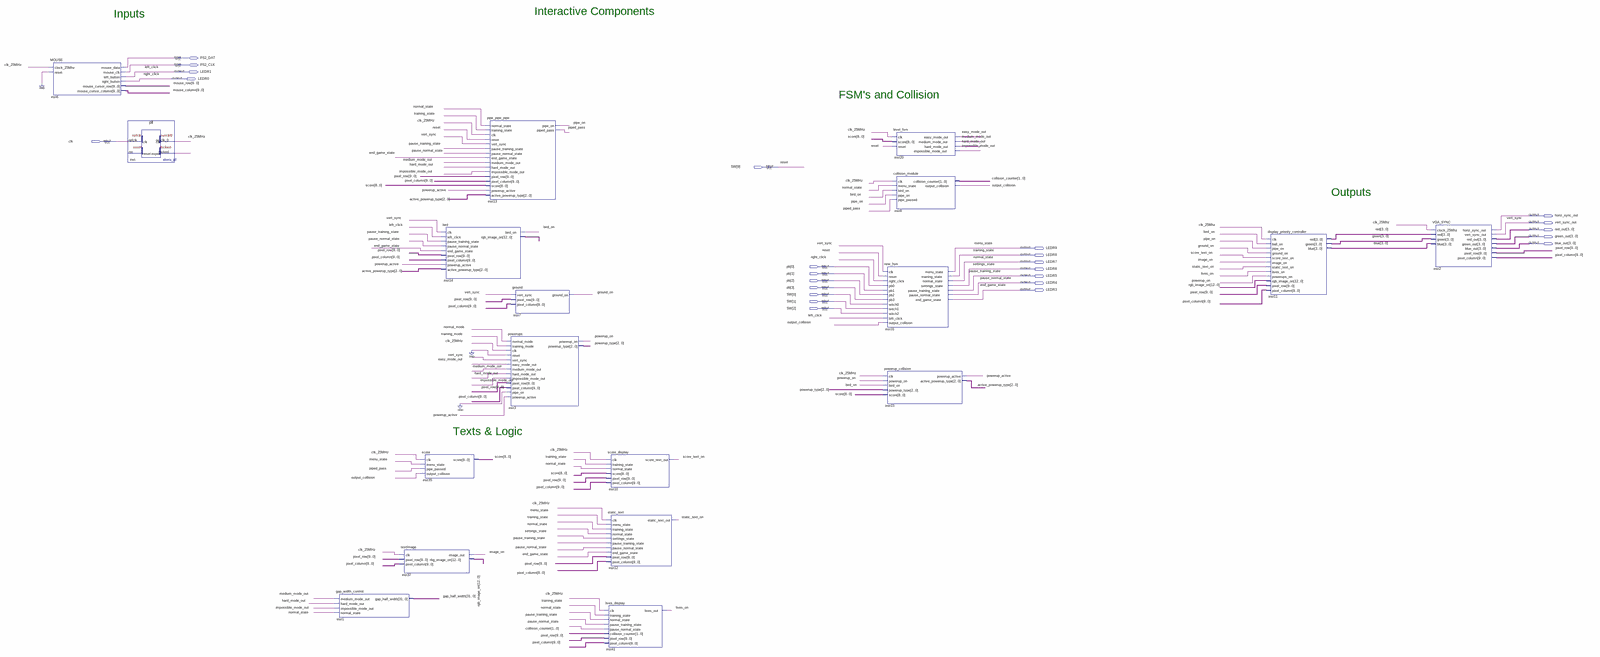
[diagram p0: schematic sheet, whole]
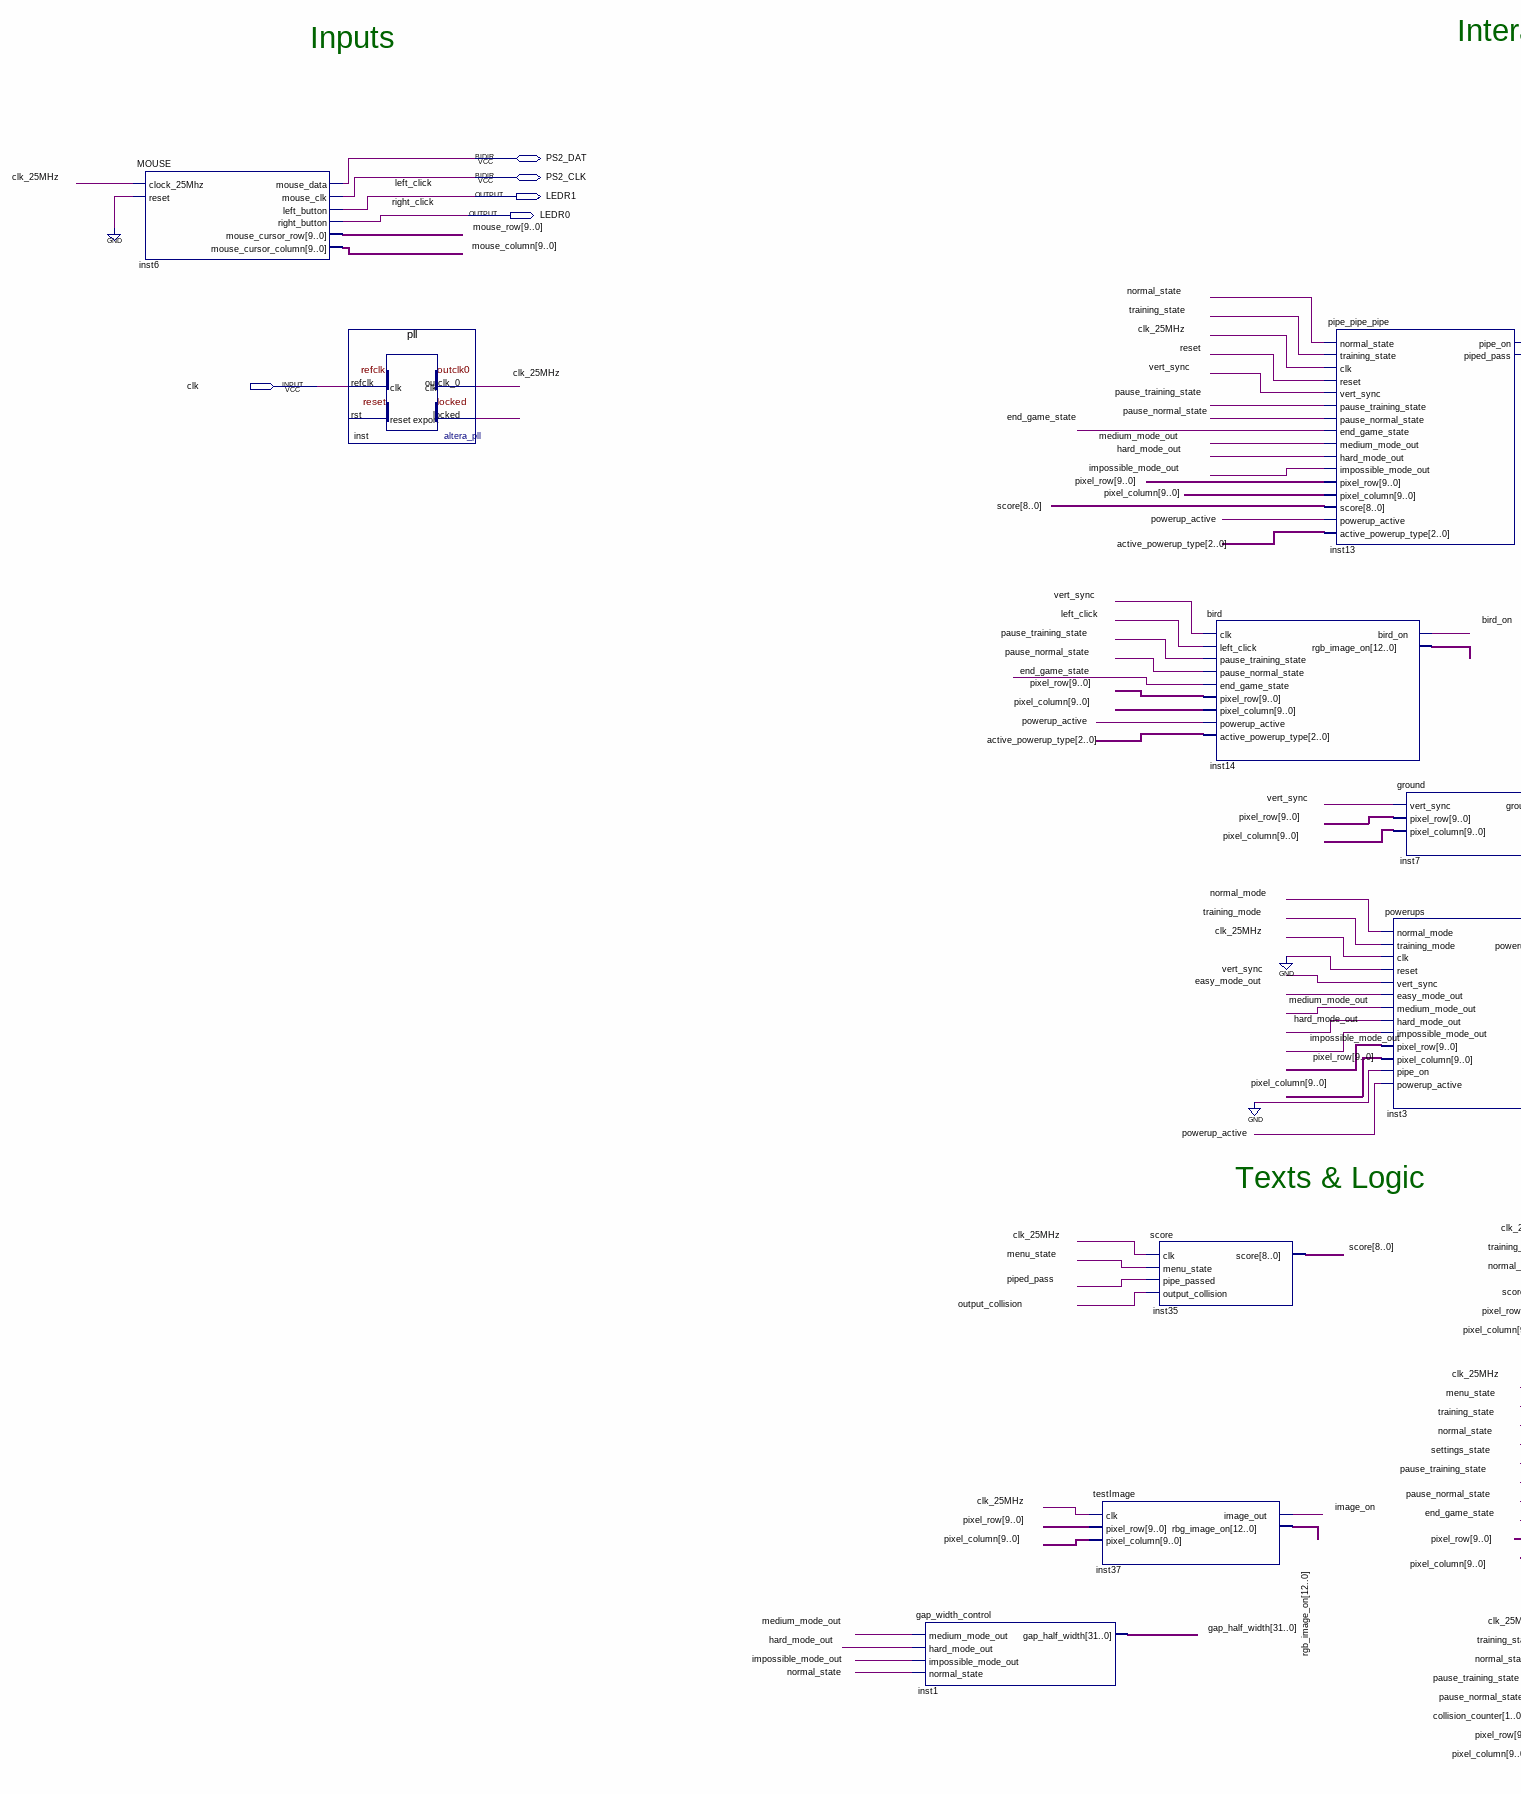
[diagram p1: schematic sheet, left part]
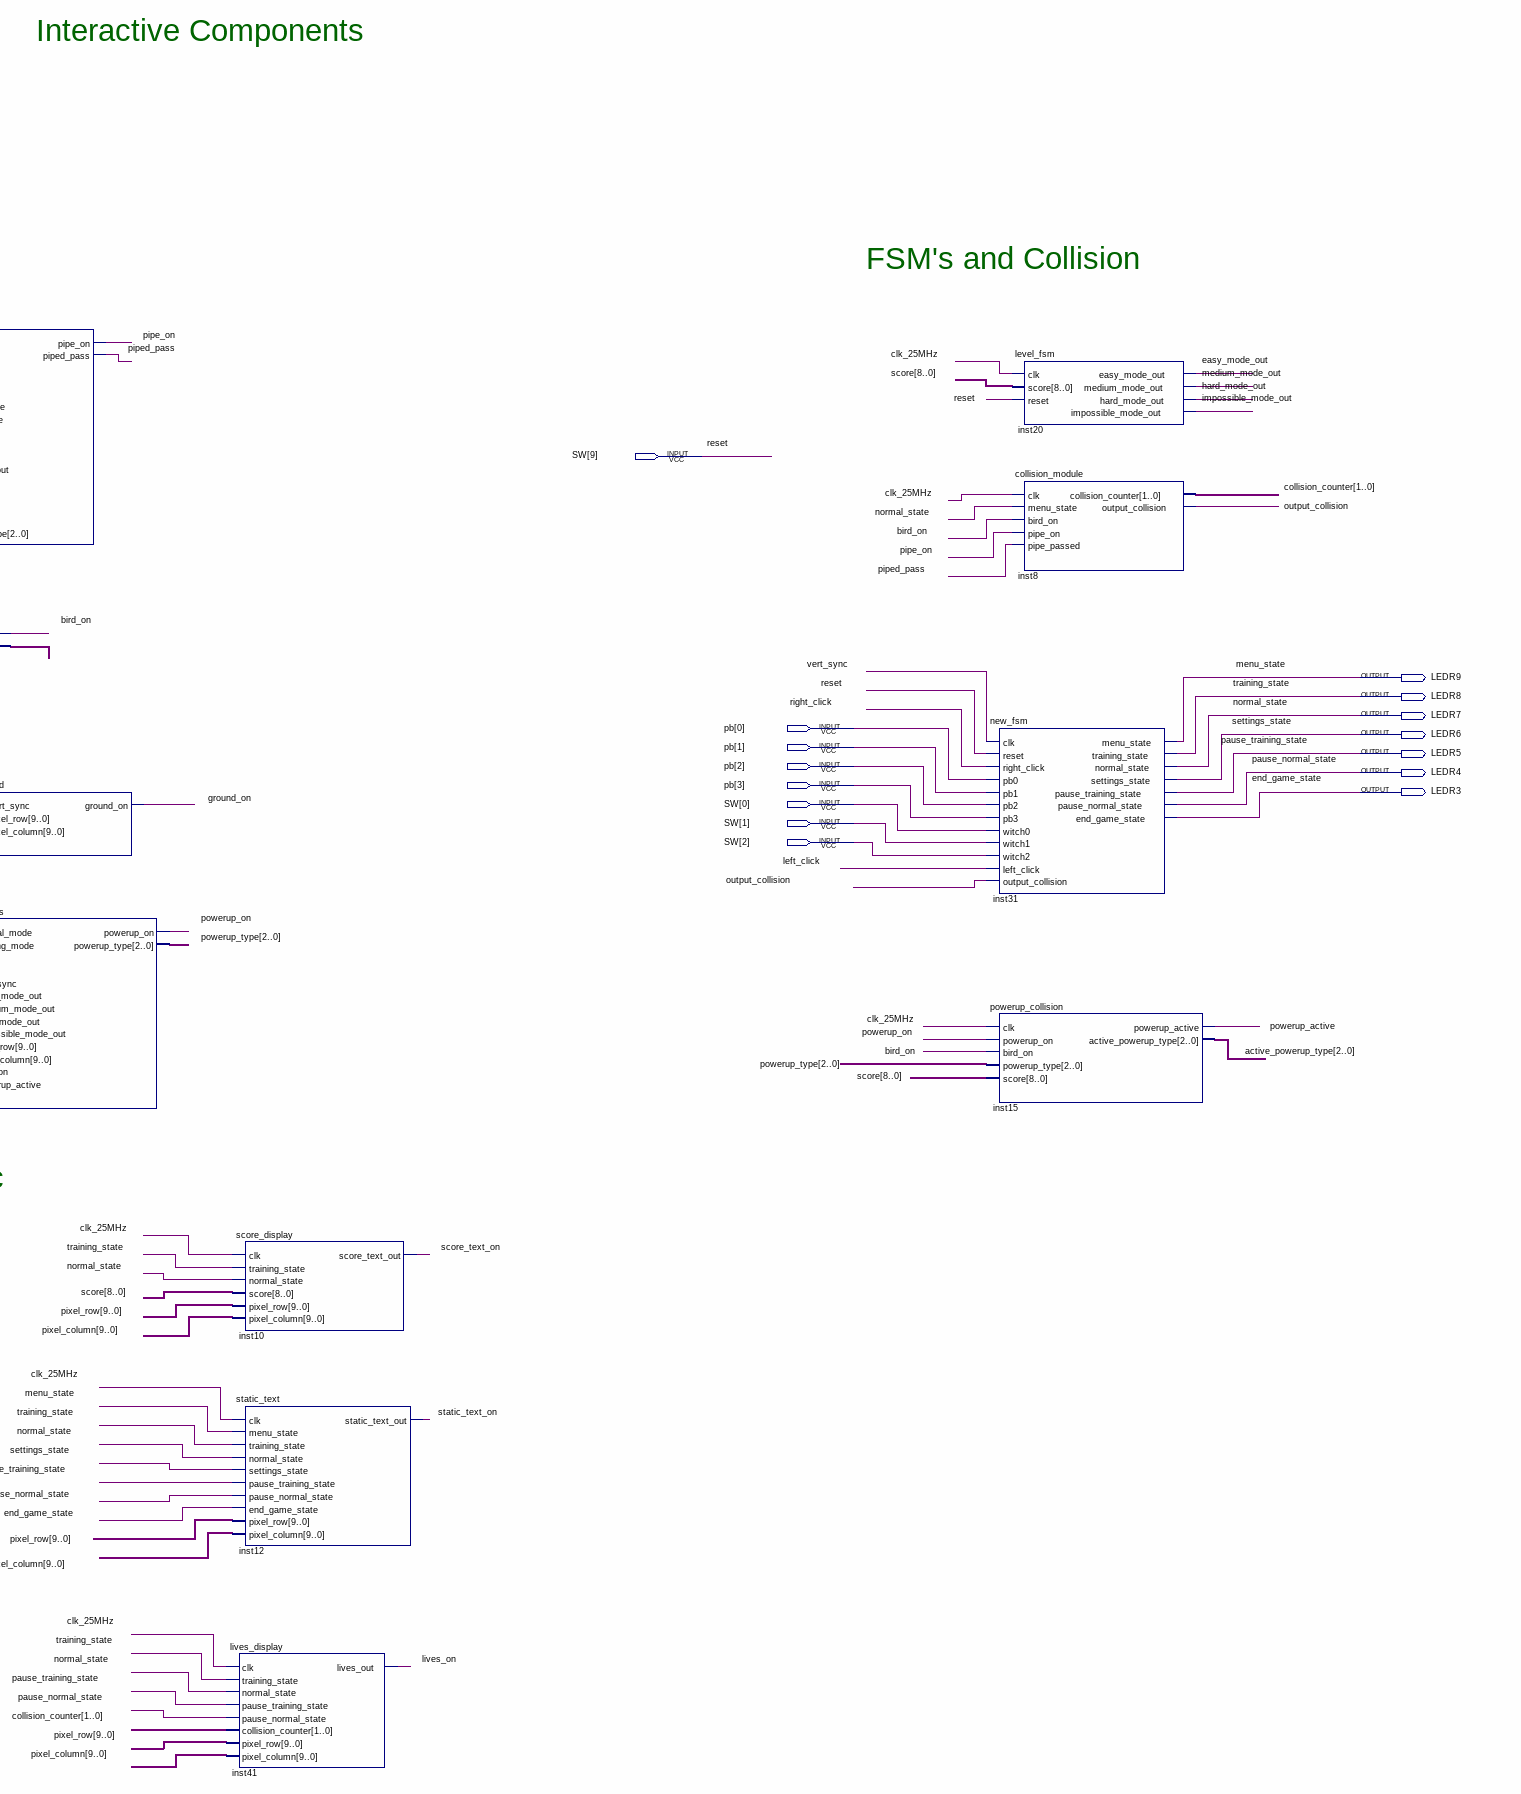
[diagram p2: schematic sheet, centre part]
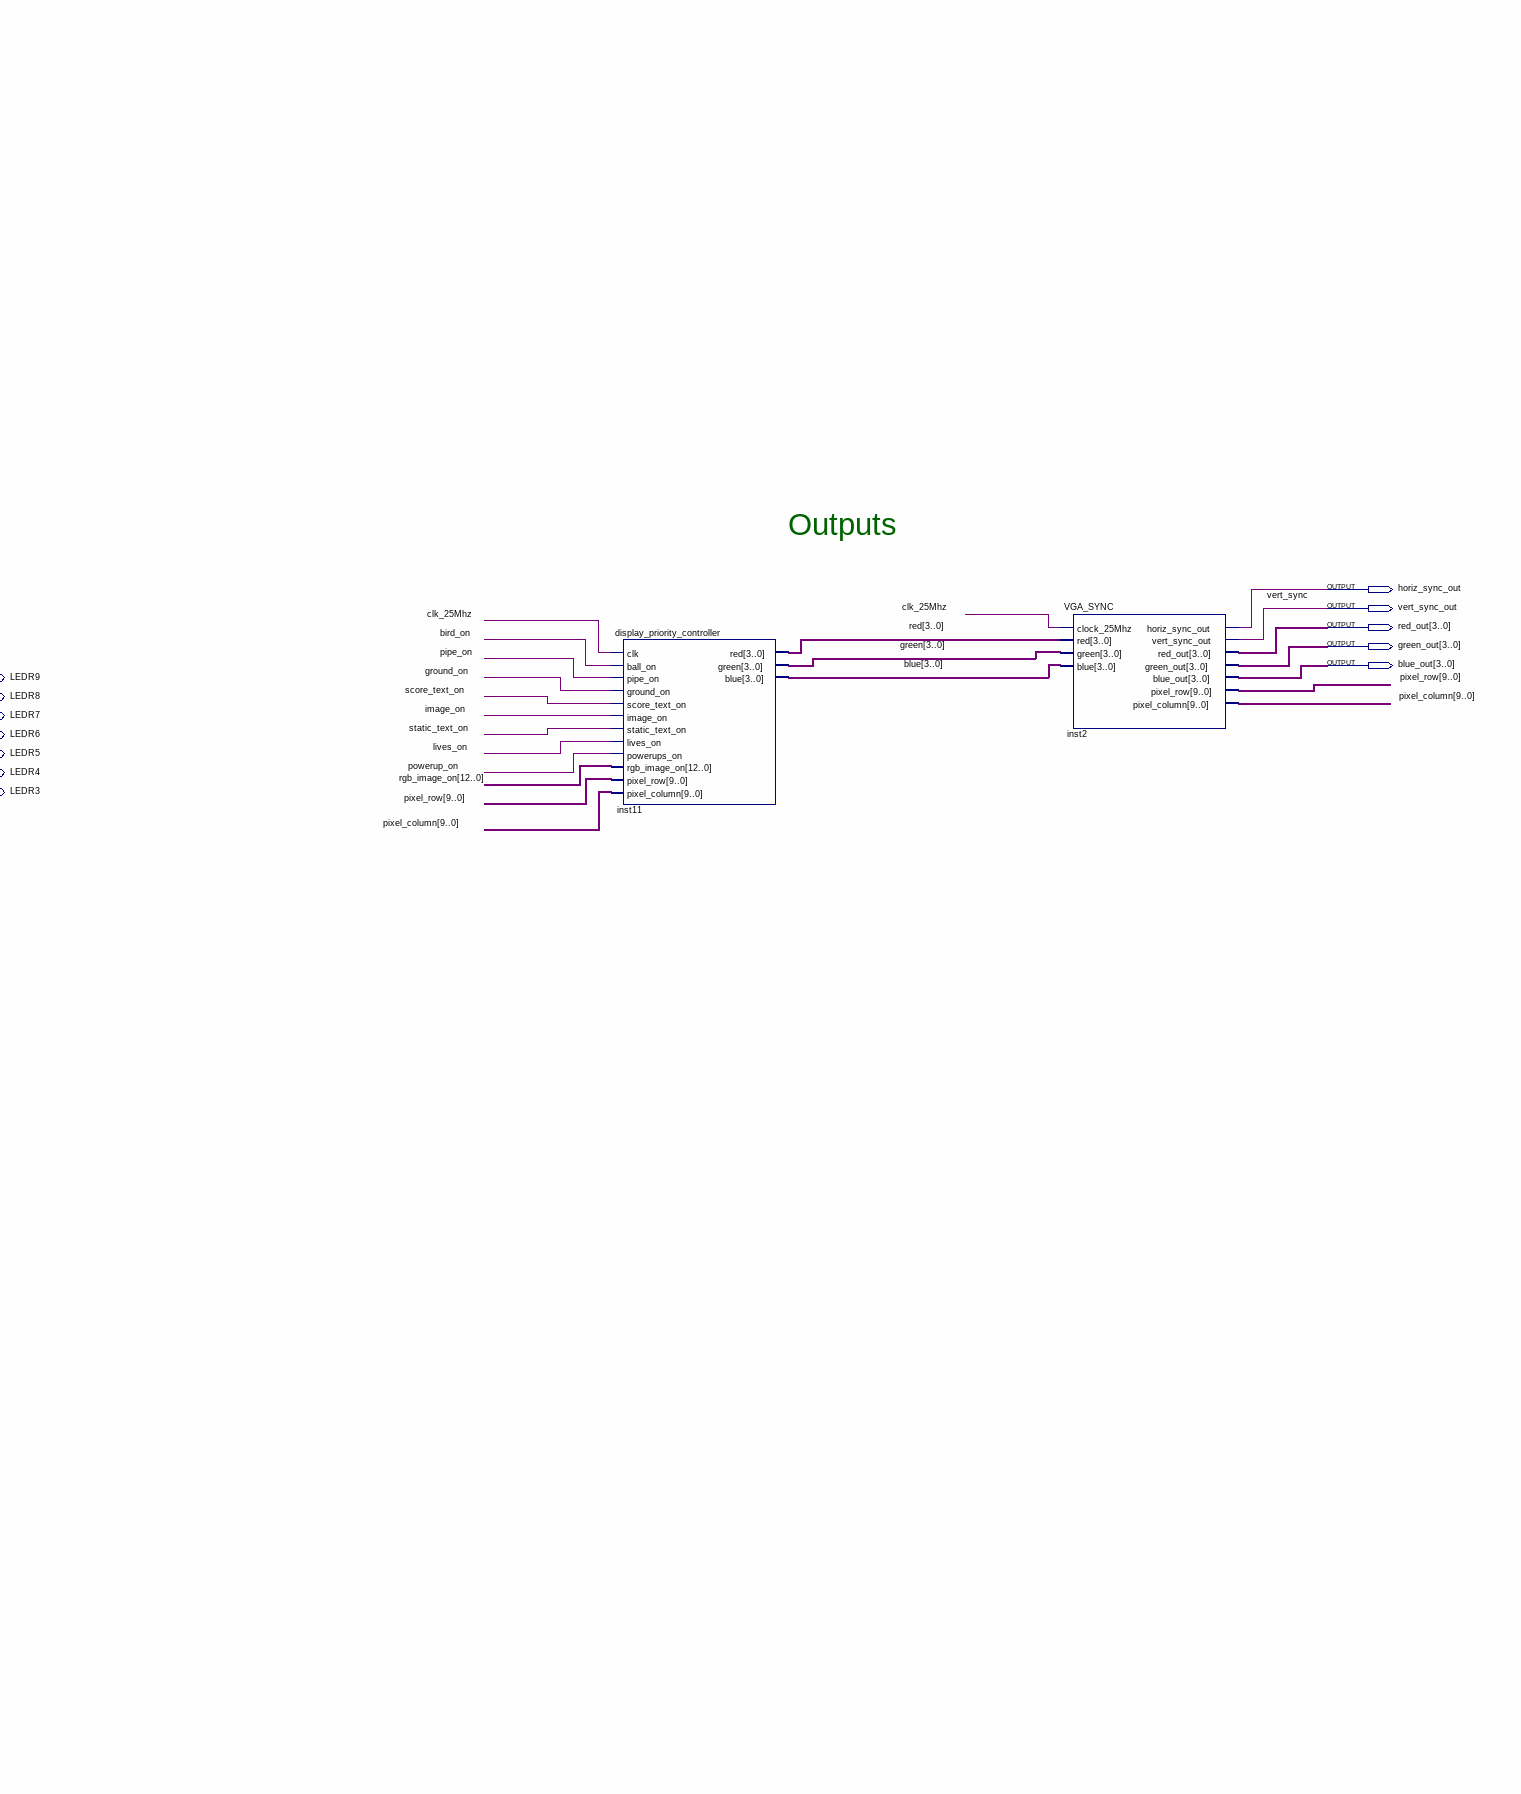
[diagram p3: schematic sheet, right part]
// Quartus schematic flappybird.bdf as structural Verilog: 18 symbols, 25 pins
module flappybird (
  input  clk,
  input  [9:0] SW,
  input  [3:0] pb,
  inout  PS2_DAT,
  inout  PS2_CLK,
  output LEDR1,
  output LEDR0,
  output horiz_sync_out,
  output vert_sync_out,
  output [3:0] red_out,
  output [3:0] green_out,
  output [3:0] blue_out,
  output LEDR9,
  output LEDR8,
  output LEDR7,
  output LEDR6,
  output LEDR5,
  output LEDR4,
  output LEDR3
);

  wire bird_on, clk_25MHz, easy_mode_out, ground_on, hard_mode_out, image_on, impossible_mode_out,
       inst_locked, lives_on, medium_mode_out, normal_mode, output_collision, pipe_on, piped_pass,
       powerup_active, powerup_on, score_text_on, static_text_on, training_mode;
  wire [1:0] collision_counter;
  wire [2:0] active_powerup_type, powerup_type;
  wire [3:0] blue, green, red;
  wire [8:0] score;
  wire [9:0] mouse_column, mouse_row, pixel_column, pixel_row;
  wire [12:0] inst14_rgb_image_on, rgb_image_on;
  wire [31:0] gap_half_width;

  MOUSE inst6 (
    .clock_25Mhz(clk_25MHz), .reset(1'b0), .left_button(LEDR1), .right_button(LEDR0),
    .mouse_cursor_row(mouse_row), .mouse_cursor_column(mouse_column), .mouse_data(PS2_DAT),
    .mouse_clk(PS2_CLK));
  pll inst (.refclk(clk), .outclk_0(clk_25MHz), .locked(inst_locked));  // open: rst
  gap_width_control inst1 (
    .medium_mode_out(medium_mode_out), .hard_mode_out(hard_mode_out),
    .impossible_mode_out(impossible_mode_out), .normal_state(LEDR7), .gap_half_width(gap_half_width));
  testImage inst37 (
    .clk(clk_25MHz), .pixel_row(pixel_row), .pixel_column(pixel_column), .image_out(image_on),
    .rbg_image_on(rgb_image_on));
  score inst35 (
    .clk(clk_25MHz), .menu_state(LEDR9), .pipe_passed(piped_pass), .output_collision(output_collision),
    .score(score));
  bird inst14 (
    .clk(vert_sync_out), .left_click(LEDR1), .pause_training_state(LEDR5), .pause_normal_state(LEDR4),
    .end_game_state(LEDR3), .pixel_row(pixel_row), .pixel_column(pixel_column),
    .powerup_active(powerup_active), .active_powerup_type(active_powerup_type), .bird_on(bird_on),
    .rgb_image_on(inst14_rgb_image_on));
  pipe_pipe_pipe inst13 (
    .normal_state(LEDR7), .training_state(LEDR8), .clk(clk_25MHz), .reset(SW[9]), .vert_sync(vert_sync_out),
    .pause_training_state(LEDR5), .pause_normal_state(LEDR4), .end_game_state(LEDR3),
    .medium_mode_out(medium_mode_out), .hard_mode_out(hard_mode_out),
    .impossible_mode_out(impossible_mode_out), .pixel_row(pixel_row), .pixel_column(pixel_column),
    .score(score), .powerup_active(powerup_active), .active_powerup_type(active_powerup_type),
    .pipe_on(pipe_on), .piped_pass(piped_pass));
  ground inst7 (.vert_sync(vert_sync_out), .pixel_row(pixel_row), .pixel_column(pixel_column), .ground_on(ground_on));
  powerups inst3 (
    .normal_mode(normal_mode), .training_mode(training_mode), .clk(clk_25MHz), .reset(1'b0),
    .vert_sync(vert_sync_out), .easy_mode_out(easy_mode_out), .medium_mode_out(medium_mode_out),
    .hard_mode_out(hard_mode_out), .impossible_mode_out(impossible_mode_out), .pixel_row(pixel_row),
    .pixel_column(pixel_column), .pipe_on(1'b0), .powerup_active(powerup_active), .powerup_on(powerup_on),
    .powerup_type(powerup_type));
  score_display inst10 (
    .clk(clk_25MHz), .training_state(LEDR8), .normal_state(LEDR7), .score(score), .pixel_row(pixel_row),
    .pixel_column(pixel_column), .score_text_out(score_text_on));
  static_text inst12 (
    .clk(clk_25MHz), .menu_state(LEDR9), .training_state(LEDR8), .normal_state(LEDR7),
    .settings_state(LEDR6), .pause_training_state(LEDR5), .pause_normal_state(LEDR4), .end_game_state(LEDR3),
    .pixel_row(pixel_row), .pixel_column(pixel_column), .static_text_out(static_text_on));
  lives_display inst41 (
    .clk(clk_25MHz), .training_state(LEDR8), .normal_state(LEDR7), .pause_training_state(LEDR5),
    .pause_normal_state(LEDR4), .collision_counter(collision_counter), .pixel_row(pixel_row),
    .pixel_column(pixel_column), .lives_out(lives_on));
  new_fsm inst31 (
    .clk(vert_sync_out), .reset(SW[9]), .right_click(LEDR0), .pb0(pb[0]), .pb1(pb[1]), .pb2(pb[2]),
    .pb3(pb[3]), .witch0(SW[0]), .witch1(SW[1]), .witch2(SW[2]), .left_click(LEDR1),
    .output_collision(output_collision), .menu_state(LEDR9), .training_state(LEDR8), .normal_state(LEDR7),
    .settings_state(LEDR6), .pause_training_state(LEDR5), .pause_normal_state(LEDR4), .end_game_state(LEDR3));
  powerup_collision inst15 (
    .clk(clk_25MHz), .powerup_on(powerup_on), .bird_on(bird_on), .powerup_type(powerup_type), .score(score),
    .powerup_active(powerup_active), .active_powerup_type(active_powerup_type));
  level_fsm inst20 (
    .clk(clk_25MHz), .score(score), .reset(SW[9]), .easy_mode_out(easy_mode_out),
    .medium_mode_out(medium_mode_out), .hard_mode_out(hard_mode_out),
    .impossible_mode_out(impossible_mode_out));
  collision_module inst8 (
    .clk(clk_25MHz), .menu_state(LEDR7), .bird_on(bird_on), .pipe_on(pipe_on), .pipe_passed(piped_pass),
    .collision_counter(collision_counter), .output_collision(output_collision));
  display_priority_controller inst11 (
    .clk(clk_25MHz), .ball_on(bird_on), .pipe_on(pipe_on), .ground_on(ground_on),
    .score_text_on(score_text_on), .image_on(image_on), .static_text_on(static_text_on), .lives_on(lives_on),
    .powerups_on(powerup_on), .rgb_image_on(rgb_image_on), .pixel_row(pixel_row),
    .pixel_column(pixel_column), .red(red), .green(green), .blue(blue));
  VGA_SYNC inst2 (
    .clock_25Mhz(clk_25MHz), .red(red), .green(green), .blue(blue), .horiz_sync_out(horiz_sync_out),
    .vert_sync_out(vert_sync_out), .red_out(red_out), .green_out(green_out), .blue_out(blue_out),
    .pixel_row(pixel_row), .pixel_column(pixel_column));

  // Other names for the same wires on the sheet: end_game_state = LEDR3; pause_training_state = LEDR5;
  //   left_click = LEDR1; menu_state = LEDR9; normal_state = LEDR7; pause_normal_state = LEDR4; reset = SW[9];
  //   right_click = LEDR0; settings_state = LEDR6; training_state = LEDR8; vert_sync = vert_sync_out

  // Notes on the sheet:
  //   Interactive Components
  //   Inputs
  //   FSM's and Collision
  //   Outputs
  //   Texts & Logic
endmodule
